# Altium project 2022_02_21_Microwatt_Board.PrjPcb
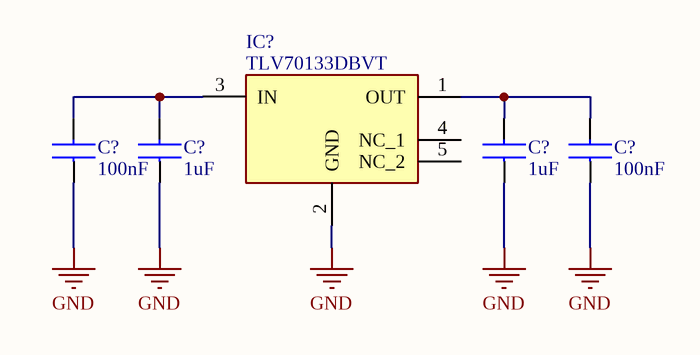
[diagram p0: Sheet1.SchDoc]
1 sheet, 5 parts. Net scope: global (net labels, ports and power ports of the same name join across sheets).
Board file: PCB2.PcbDoc

## Sheet Sheet1.SchDoc
size A; SheetNumber: 1; SheetTotal: 1

### Parts
(Parts that share a designator on the sheet are numbered #1, #2 ... from top to bottom, then left to right.)
C?#1  value 100nF  [CAPC2012X135N]  (hidden comment: C0805C104K5RAC7411)
C?#2  value 1uF  [CAPC2012X135N]  (hidden comment: 885012107015)
C?#3  value 1uF  [CAPC2012X135N]  (hidden comment: 885012107015)
C?#4  value 100nF  [CAPC2012X135N]  (hidden comment: C0805C104K5RAC7411)
IC?  TLV70133DBVT  [SOT95P280X145-5N]

### Nets
GND: C?#1.1 C?#2.1 C?#3.1 C?#4.1 IC?.2(GND)
NetC?#1_2: C?#1.2 C?#2.2 IC?.3(IN)
NetC?#3_2: C?#3.2 C?#4.2 IC?.1(OUT)

Not connected (* = marked no-connect by the designer): IC? 4(NC_1) 5(NC_2)

### Library data of the parts
C?#1 C?#4 = C0805C104K5RAC7411: Capacitor; Manufacturer_Name: Kemet; Datasheet Link: https://www.mouser.com/datasheet/2/212/KEM_C1002_X7R_SMD-1102033.pdf; Height: 0.88mm; Manufacturer_Part_Number: C0805C104K5RAC7411; Mouser Part Number: 80-C0805C104K5RACLR; Mouser Price/Stock: https://www.mouser.co.uk/ProductDetail/KEMET/C0805C104K5RAC7411?qs=jbRM9o5BbzPcVXF0wW9AYg%3D%3D; Arrow Part Number: C0805C104K5RAC7411; Arrow Price/Stock: https://www.arrow.com/en/products/c0805c104k5rac7411/kemet-corporation
C?#2 C?#3 = 885012107015: Capacitor; Manufacturer_Name: Wurth Elektronik; Datasheet Link: https://katalog.we-online.com/pbs/datasheet/885012107015.pdf; Height: 1.35mm; Manufacturer_Part_Number: 885012107015; Mouser Part Number: 710-885012107015; Mouser Price/Stock: https://www.mouser.co.uk/ProductDetail/Wurth-Elektronik/885012107015?qs=0KOYDY2FL2%252BNQREZP%252BtVoQ%3D%3D
IC? = TLV70133DBVT: Integrated Circuit; Manufacturer_Name: Texas Instruments; Datasheet Link: http://www.ti.com/lit/ds/symlink/tlv701.pdf; Height: 1.45mm; Manufacturer_Part_Number: TLV70133DBVT; Mouser Part Number: 595-TLV70133DBVT; Mouser Price/Stock: https://www.mouser.co.uk/ProductDetail/Texas-Instruments/TLV70133DBVT?qs=bhx7MkwkKU%2FDAU6iALOLyg%3D%3D; Arrow Part Number: TLV70133DBVT; Arrow Price/Stock: https://www.arrow.com/en/products/tlv70133dbvt/texas-instruments?region=nac